# EAGLE design stm32-lqfp64-enc28j60 (EAGLE 7.2.0)
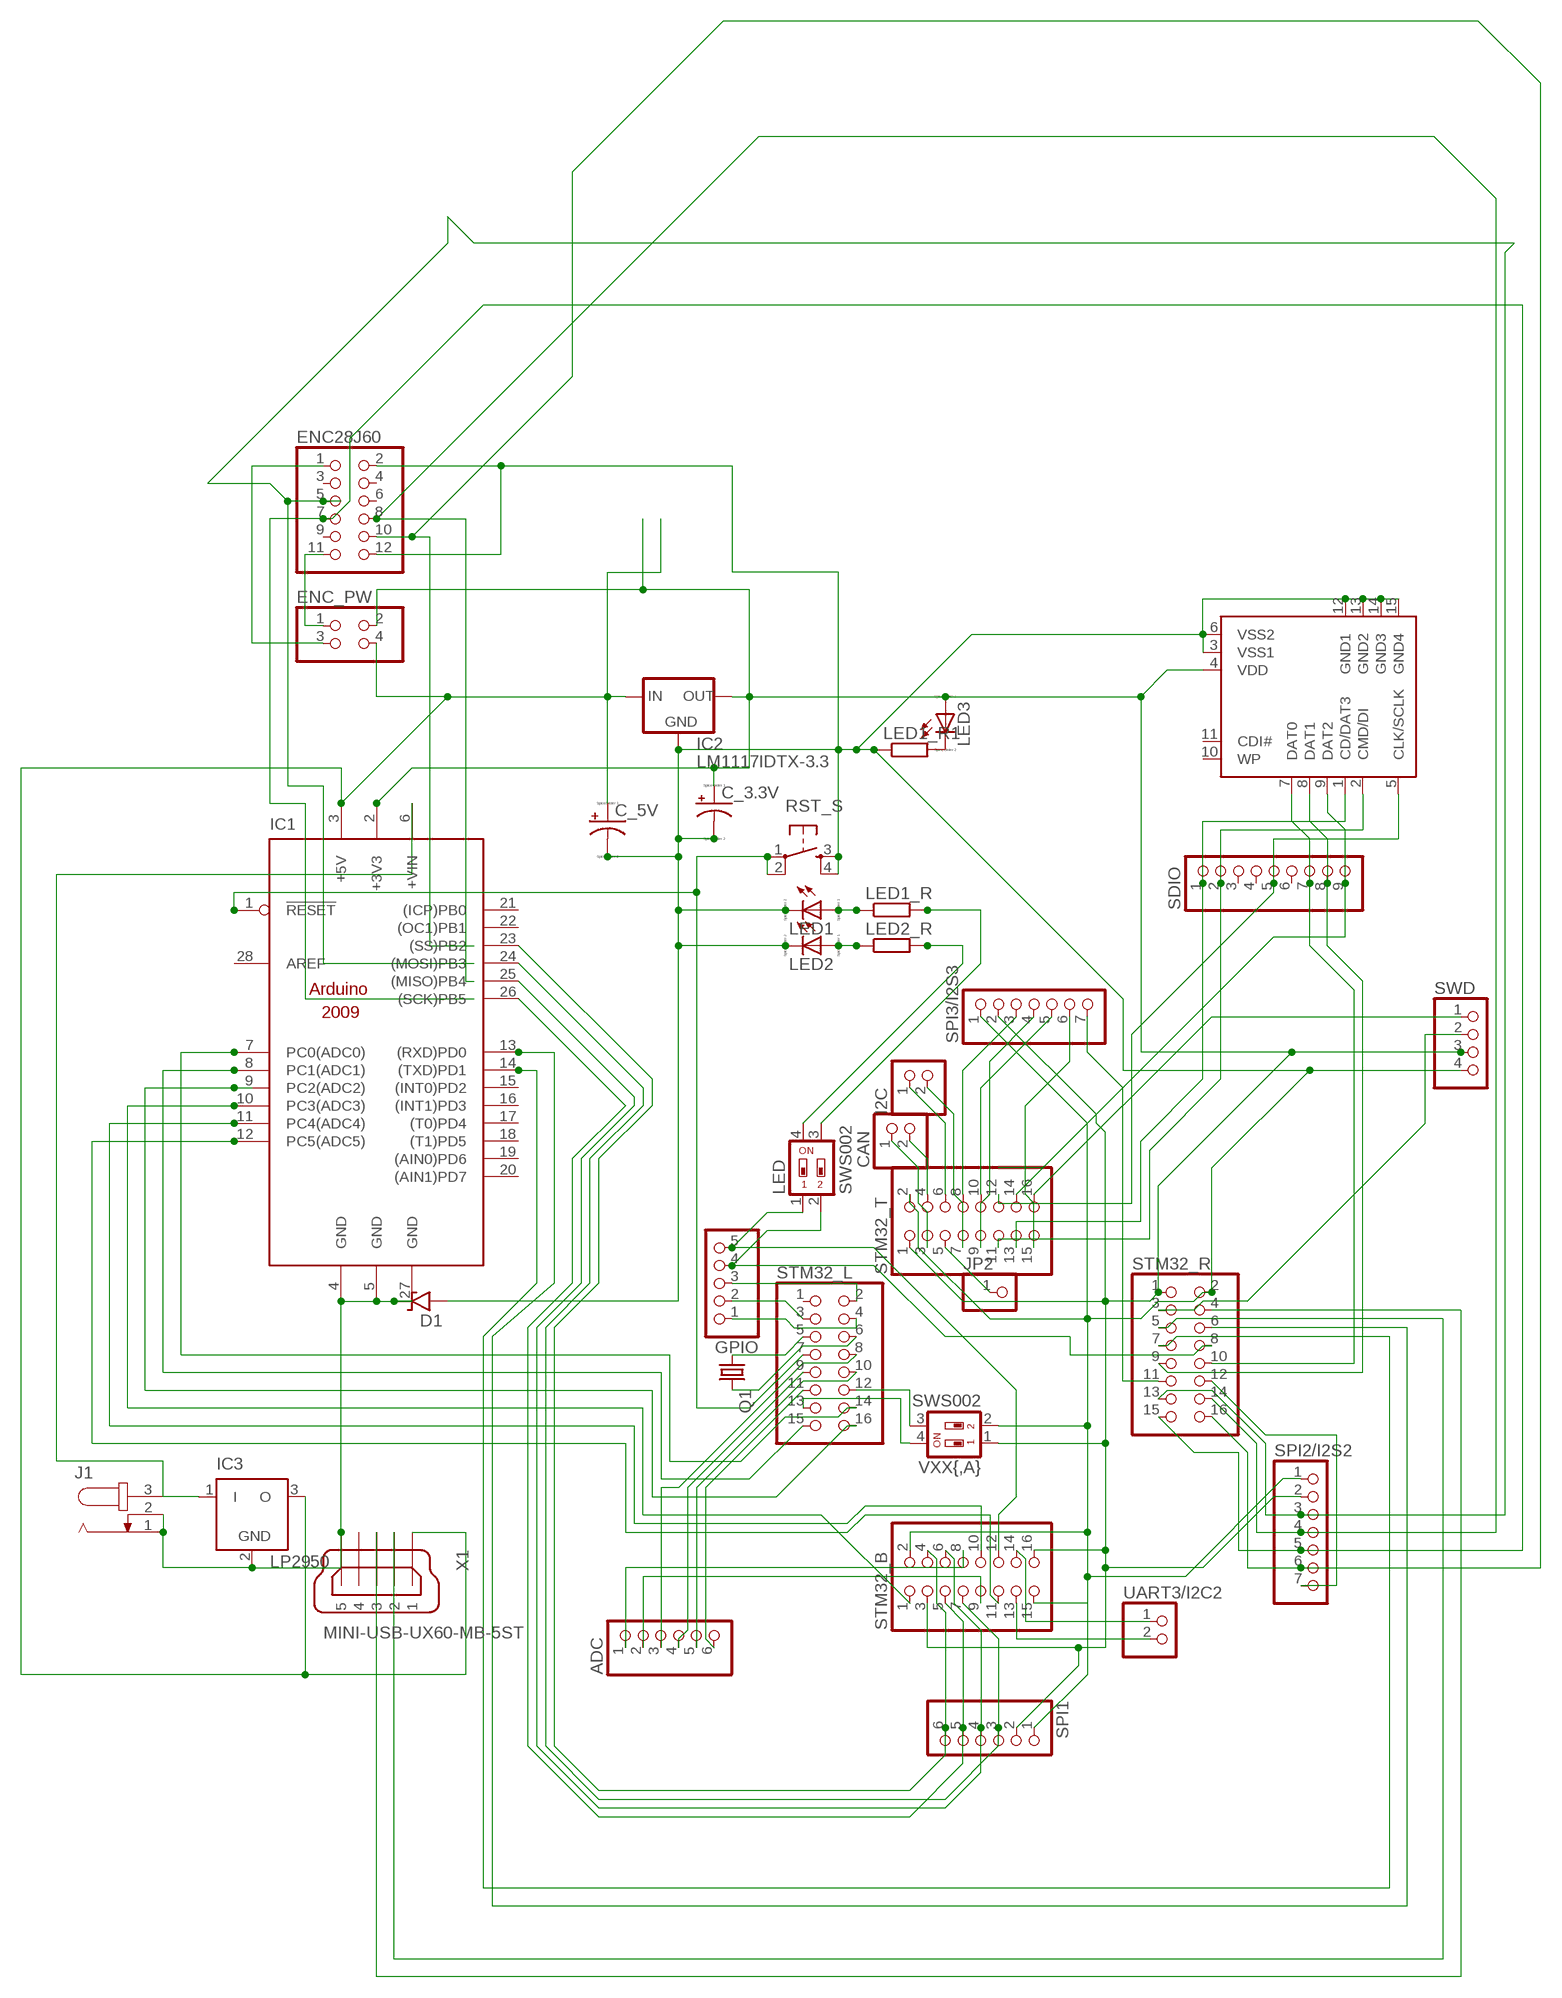
[diagram p0: schematic, sheet 1]

## Parts
ADC  PINHD-1X06_2.54-S  [1X06-S]
C_3.3V  CPOL-USE3.5-8  [E3,5-8]
C_5V  CPOL-USE3.5-8  [E3,5-8]
CAN  PINHD-1X02_2.54-S  [1X02-S]
D1  1N9ZENER2  [DO35-2]
ENC28J60  PINHD-2X6_2.54  [2X06]
ENC_PW  PINHD-2X2_2.54  [2X02]
GPIO  PINHD-1X05_2.54-S  [1X05-S]
I2C  PINHD-1X02_2.54-S  [1X02-S]
IC1  ARDUINO2009_PIN_12  [ARDUINO2009_2]
IC2  LM1117IDTX-3.3  [TO252]
IC3  LP2950  [DPACK]
J1  JACK-PLUG0  [SPC4077]
JP2  PINHD-1X01_2.54-S  [1X01-S]
LED  SWS002  [SMS-002]
LED1  LED_ELD260  [LED_LD260]
LED1_R  R-EU_0204/7  [0204/7]
LED1_R1  R-EU_0204/7  [0204/7]
LED2  LED_ELD260  [LED_LD260]
LED2_R  R-EU_0204/7  [0204/7]
LED3  LED_ELD260  [LED_LD260]
Q1  CRYSTALHC49S  [HC49/S]
RST_S  TAC_SWITCHPTH  [TACTILE-PTH]
SDIO  PINHD-1X09_2.54-S  [1X09-S]
SPI1  PINHD-1X06_2.54-S  [1X06-S]
SPI2/I2S2  PINHD-1X07_2.54-S  [1X07-S]
SPI3/I2S3  PINHD-1X07_2.54-S  [1X07-S]
STM32_B  PINHD-2X08_2.54  [2X08]
STM32_L  PINHD-2X08_2.54  [2X08]
STM32_R  PINHD-2X08_2.54  [2X08]
STM32_T  PINHD-2X08_2.54  [2X08]
SWD  PINHD-1X4  [1X04]
U$2  SDCARDVAR1  [SDCMF-10915W010]
UART3/I2C2  PINHD-1X02_2.54-S  [1X02-S]
VXX{,A}  SWS002  [SMS-002]
X1  MINI-USB-UX60-MB-5ST  [UX60-MB-5ST]

## Nets
5V: C_5V.+ ENC_PW.4 IC1.3(+5V) IC2.2(IN) IC3.3(O) X1.1
ADC1: IC1.8(PC1(ADC1)) STM32_L.15
ADC2: IC1.9(PC2(ADC2)) STM32_L.16
ADC3: IC1.10(PC3(ADC3)) STM32_B.1
ADC4: IC1.11(PC4(ADC4)) STM32_B.10
ADC5: IC1.12(PC5(ADC5)) STM32_B.11
ADC_0: IC1.7(PC0(ADC0)) STM32_L.14
GND: C_3.3V.- C_5V.- D1.A ENC28J60.2 ENC28J60.12 IC2.1(GND) LED1.K(C) LED1_R1.1 LED2.K(C) RST_S.3 RST_S.4 SPI1.1 SPI2/I2S2.1 SPI3/I2S3.1 STM32_B.2 STM32_B.15 STM32_R.2 STM32_T.2 SWD.4 U$2.3(VSS1) U$2.6(VSS2) U$2.12(GND1) U$2.13(GND2) U$2.14(GND3) U$2.15(GND4) VXX{,A}.2
GND_RAW: D1.C IC1.4(GND) IC1.5(GND) IC1.27(GND) IC3.2(GND) J1.1 J1.2 X1.5
GPIO_FREE1: GPIO.3 STM32_L.2
GPIO_FREE2: GPIO.2 STM32_L.3
GPIO_FREE3: GPIO.1 STM32_L.4
GPIO_FREE4: GPIO.5 LED.1 STM32_B.12
I2C1_SCL: I2C.2 STM32_T.7
I2C1_SDA: I2C.1 STM32_T.6
N$1: SPI3/I2S3.7 STM32_R.11
N$2: CAN.1 STM32_T.3
N$3: CAN.2 STM32_T.4
N$4: JP2.1 STM32_T.5
N$5: STM32_L.13 VXX{,A}.4
N$6: STM32_L.12 VXX{,A}.3
N$7: SPI3/I2S3.3 STM32_T.8
N$8: SPI3/I2S3.4 STM32_T.9
N$9: SPI3/I2S3.5 STM32_T.10
N$11: ADC.1 STM32_B.8
N$12: ADC.3 STM32_L.8
N$13: ADC.2 STM32_B.9
N$14: LED1_R.2 LED.3
N$15: ADC.4 STM32_L.9
N$16: ADC.5 STM32_L.10
N$17: ADC.6 STM32_L.11
N$18: STM32_B.13 UART3/I2C2.2
N$19: STM32_B.14 UART3/I2C2.1
N$20: SPI3/I2S3.6 STM32_T.15
N$21: SPI2/I2S2.7 STM32_R.12
N$22: IC1.13((RXD)PD0) STM32_R.6
N$23: SDIO.5 STM32_T.12 U$2.5(CLK/SCLK)
N$24: IC1.6(+VIN) IC3.1(I) J1.3
N$26: LED2.A LED2_R.1
N$27: LED1.A LED1_R.1
N$28: LED2_R.2 LED.4
N$46: GPIO.4 LED.2 STM32_R.8
N$47: IC1.14((TXD)PD1) STM32_R.7
N$49: STM32_R.5 X1.2
N$50: STM32_R.4 X1.3
N$187: ENC28J60.1 ENC_PW.3
N$188: ENC28J60.11 ENC_PW.1
N$242: LED1_R1.2 LED3.K(C)
RCC_OSC_IN: Q1.1 STM32_L.5
RCC_OSC_OUT: Q1.2 STM32_L.6
RST: IC1.1(!RESET) RST_S.1 RST_S.2 STM32_L.7
SDIO_CMD: SDIO.2 STM32_T.11 U$2.2(CMD/DI)
SDIO_D0: SDIO.7 STM32_R.10 U$2.7(DAT0)
SDIO_D1: SDIO.8 STM32_R.9 U$2.8(DAT1)
SDIO_D2: SDIO.9 STM32_T.14 U$2.9(DAT2)
SDIO_D3: SDIO.1 STM32_T.13 U$2.1(CD/DAT3)
SPI1_MISO: IC1.25((MISO)PB4) SPI1.4 STM32_B.6
SPI1_MOSI: IC1.24((MOSI)PB3) SPI1.3 STM32_B.7
SPI1_NSS: IC1.23((SS)PB2) SPI1.6 STM32_B.4
SPI1_SCK: IC1.26((SCK)PB5) SPI1.5 STM32_B.5
SPI2_MISO: ENC28J60.8 SPI2/I2S2.4 STM32_R.14
SPI2_MOSI: ENC28J60.5 SPI2/I2S2.3 STM32_R.13
SPI2_NSS: ENC28J60.10 SPI2/I2S2.6 STM32_R.16
SPI2_SCK: ENC28J60.7 SPI2/I2S2.5 STM32_R.15
SWD_CLK: STM32_T.16 SWD.1
SWD_IO: STM32_R.3 SWD.2
VDD: C_3.3V.+ ENC_PW.2 IC1.2(+3V3) IC2.TAB(OUT) LED3.A SPI1.2 SPI2/I2S2.2 SPI3/I2S3.2 STM32_B.3 STM32_B.16 STM32_R.1 STM32_T.1 SWD.3 U$2.4(VDD) VXX{,A}.1
Unconnected: ENC28J60.3 ENC28J60.4 ENC28J60.6 ENC28J60.9 IC1.15((INT0)PD2) IC1.16((INT1)PD3) IC1.17((T0)PD4) IC1.18((T1)PD5) IC1.19((AIN0)PD6) IC1.20((AIN1)PD7) IC1.21((ICP)PB0) IC1.22((OC1)PB1) IC1.28(AREF) SDIO.3 SDIO.4 SDIO.6 STM32_L.1 U$2.10(WP) U$2.11(CDI#) X1.4

## Library data of the parts
ADC SPI1 = pinhead-2:PINHD-1X06: PIN HEADER
C_3.3V C_5V = resistor:CPOL-US: POLARIZED CAPACITOR, American symbol
CAN I2C UART3/I2C2 = pinhead-2:PINHD-1X02: PIN HEADER
D1 = gm-diodes:1N9*ZENER: 1N9???B Zener Diode DO-35 case 1N957B - 1N992B (6.8V to 200V)
ENC28J60 = pinhead-1:PINHD-2X6: PIN HEADER
ENC_PW = pinhead-1:PINHD-2X2: PIN HEADER
GPIO = pinhead-2:PINHD-1X05: PIN HEADER
IC1 = arduino:ARDUINO2009_PIN_1: The Arduino Duemilanove ("2009") is a microcontroller board based on the ATmega168 or ATmega328. - 14 digital input/output pins (of which 6 can be used as PWM outputs) - 6 analog inputs, a 16 MHz crystal oscillator - USB connection - power jack - ISP header - reset button It contains everything needed to support the microcontroller; simply connect it to a computer with a USB cable or power it with a AC-to-DC adapter or battery to get started http://arduino.cc/en/Main/ArduinoBoardDuemilanove
IC2 = lm1117:LM1117IDTX-*
IC3 = linear:LP2950: 100 mA, Low Power Low Dropout Voltage Regulator Source: http://www.onsemi.com/pub/Collateral/LP2950-D.PDF
J1 = tango:JACK-PLUG: DC POWER JACK Power Jack, DC, Right Angle, Through Hole, Rated 5A at 16VDC, PC Terminals Distributor: Farnell (www.Farnell.de) Drawing: 84N1161.pdf / 84N1162.pdf Manufacturer: SPC Technology (www.spctechnology.com) Type: SPC4077 / SPC 4078
JP2 = pinhead-2:PINHD-1X01: PIN HEADER
LED VXX{,A} = smd-special:SWS002: SMD Dip Switch 2 pol.
LED1-LED3 = eagle-ltspice:LED_E: LED Source: http://www.osram.convergy.de Source: www.luxeon.com Source: www.kingbright.com; SPICEMODEL: NONE; SPICEPREFIX: D; SPICETYPE: diode
LED1_R LED1_R1 LED2_R = resistor:R-EU_: RESISTOR, European symbol
Q1 = crystal:CRYSTAL: CRYSTAL; OC_FARNELL: 1667008; OC_NEWARK: unknown
RST_S = SparkFun:TAC_SWITCH: Momentary Switch Button commonly used for reset or general input. Spark Fun Electronics SKU : COM-00097
SDIO = pinhead-2:PINHD-1X09: PIN HEADER
SPI2/I2S2 SPI3/I2S3 = pinhead-2:PINHD-1X07: PIN HEADER
STM32_B STM32_L STM32_R STM32_T = pinhead-2:PINHD-2X08: PIN HEADER
SWD = pinhead:PINHD-1X4: PIN HEADER
U$2 = kingfont_sdcmf10915w010:SDCARD: SD card connector KINGFONT SDCMF-10915W010
X1 = con-hirose:MINI-USB-: MINI USB Connector Source: http://www.hirose.co.jp/cataloge_hp/e24000019.pdf; OC_FARNELL: unknown; OC_NEWARK: unknown

## Board
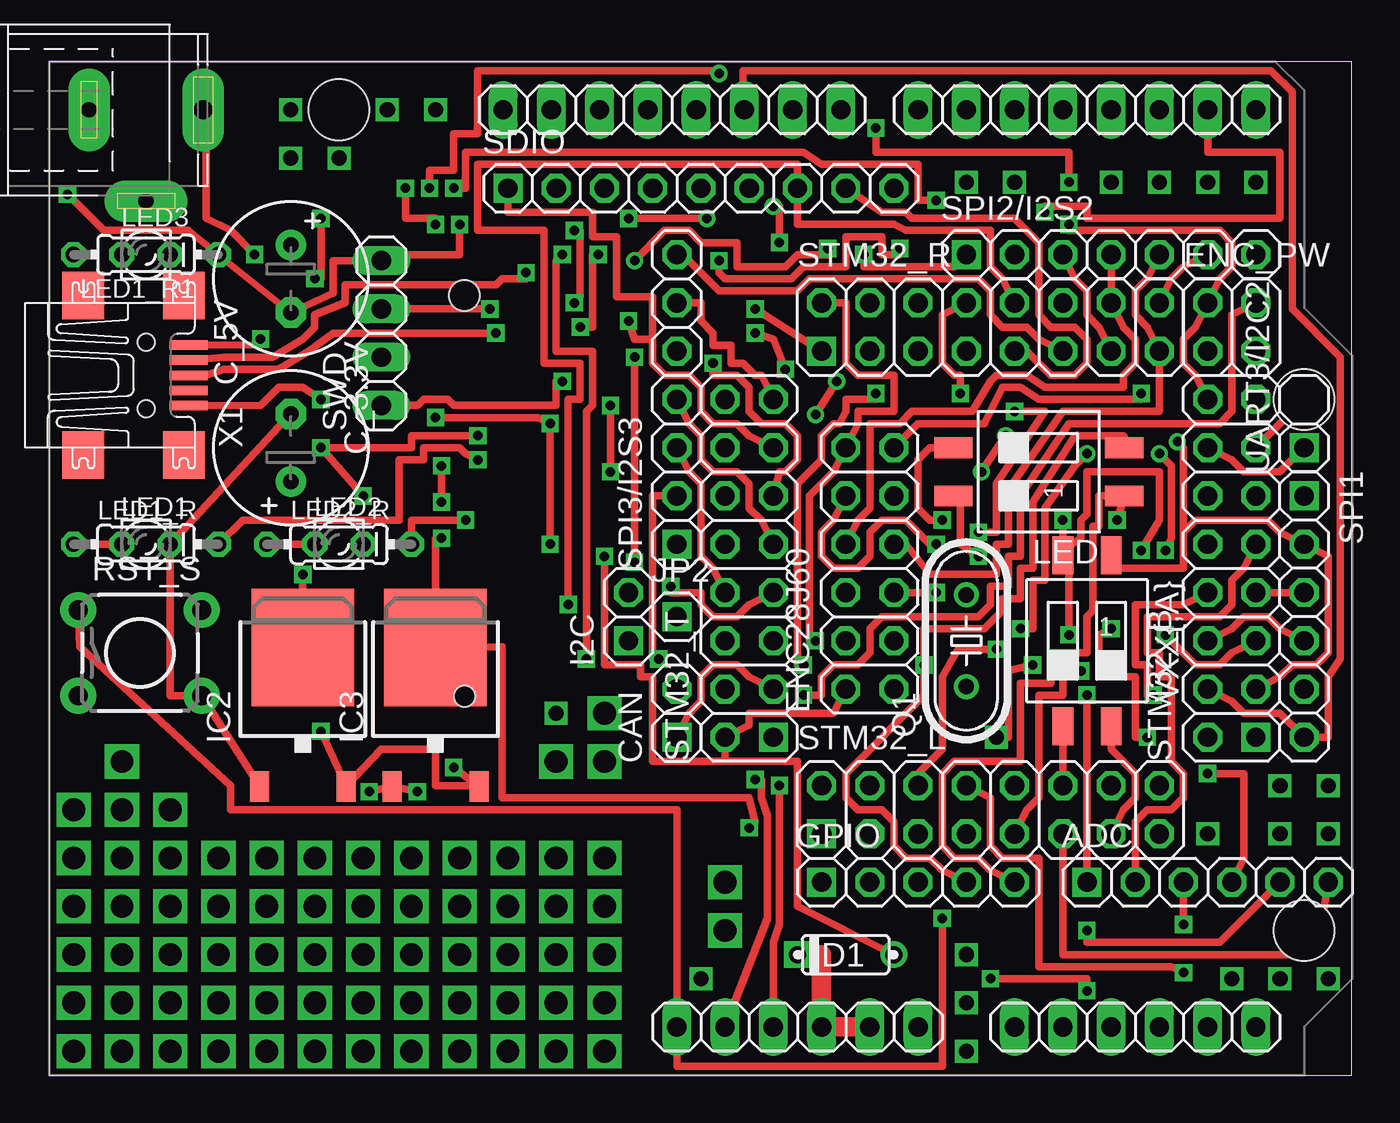
[diagram p1: board, top side]
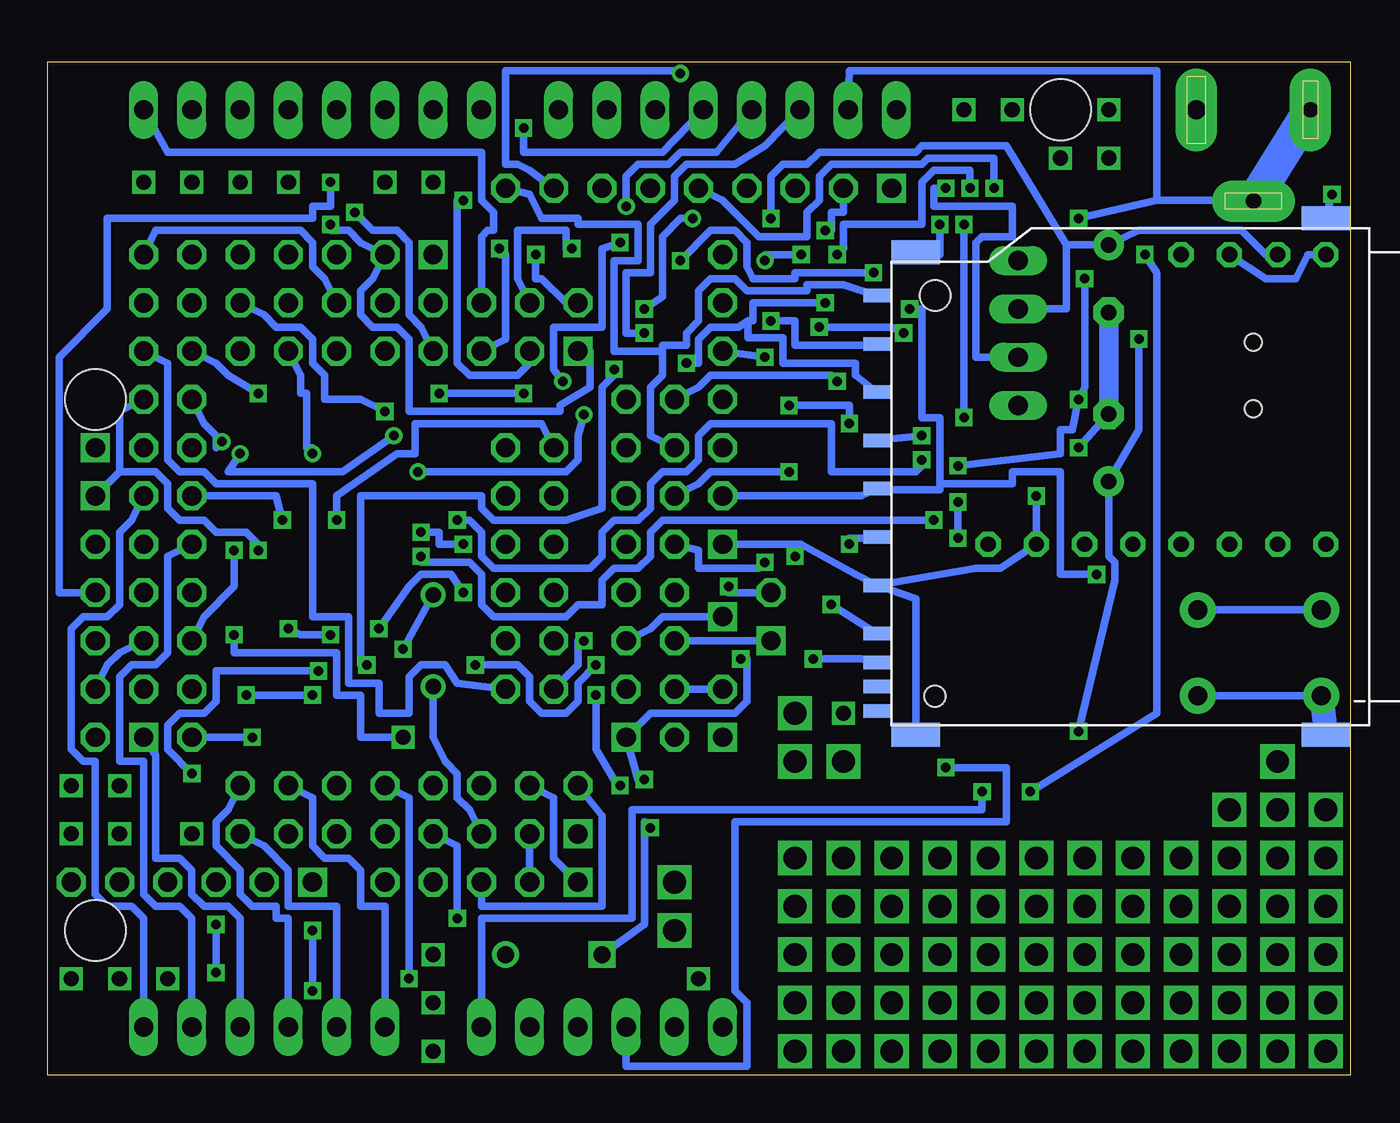
[diagram p2: board, bottom side, seen from below]

Size 68.56 x 53.33 mm. Coordinates in mm from the lower left corner, seen from the top.
Outline: 0,0 68.56,0 68.56,53.33 0,53.33 0,0
Copper layers (1*16): Top 0.035mm / dielectric 1.5mm / Bottom 0.035mm
Design rules "default": minimum track width 10mil, minimum drill 24mil, track to track 8mil, track to pad 8mil, pad to pad 8mil, via to via 8mil, smd to smd 8mil, copper to edge 40mil, drill to drill 8mil, minimum pad ring 10mil, minimum via ring 8mil, stop-mask expansion 4mil, vias tented up to drill 0mil, thermal gap 10mil

### Footprints (pad centres in the part's own frame; a part is rotated, then mirrored left to right if it is on the bottom)
1X06-S = drill 1.016 square: 1 -6.35,0 | drill 1.016 octagon: 2 -3.81,0; 3 -1.27,0; 4 1.27,0; 5 3.81,0; 6 6.35,0
E3,5-8 = drill 0.813 pad 1.6: + -1.778,0 | drill 0.813 pad 1.6 octagon: - 1.778,0
1X02-S = drill 1.016 square: 1 -1.27,0 | drill 1.016 octagon: 2 1.27,0
DO35-2 = drill 0.9: A 2.54,0 | drill 0.9 square: C -2.54,0
2X06 = drill 1.016 octagon: 1 -6.35,-1.27; 2 -6.35,1.27; 3 -3.81,-1.27; 4 -3.81,1.27; 5 -1.27,-1.27; 6 -1.27,1.27; 7 1.27,-1.27; 8 1.27,1.27; 9 3.81,-1.27; 10 3.81,1.27; 11 6.35,-1.27; 12 6.35,1.27
2X02 = drill 1.016 octagon: 1 -1.27,-1.27; 2 -1.27,1.27; 3 1.27,-1.27; 4 1.27,1.27
1X05-S = drill 1.016 square: 1 -5.08,0 | drill 1.016 octagon: 2 -2.54,0; 3 0,0; 4 2.54,0; 5 5.08,0
ARDUINO2009_2 = drill 1.016 long: 1 33.02,2.54; 2 35.56,2.54; 3 38.1,2.54; 4 40.64,2.54; 5 43.18,2.54; 6 45.72,2.54; 7 50.8,2.54; 8 53.34,2.54; 9 55.88,2.54; 10 58.42,2.54; 11 60.96,2.54; 12 63.5,2.54; 13 63.5,50.8; 14 60.96,50.8; 15 58.42,50.8; 16 55.88,50.8; 17 53.34,50.8; 18 50.8,50.8; 19 48.26,50.8; 20 45.72,50.8; 21 41.656,50.8; 22 39.116,50.8; 23 36.576,50.8; 24 34.036,50.8; 25 31.496,50.8; 26 28.956,50.8; 27 26.416,50.8; 28 23.876,50.8 | hole 3.2: 15.24,50.8; 66.04,35.56; 66.04,7.62
TO252 = smd 1 x 1.6: 1 -2.28,-4.8; 2 2.28,-4.8 | smd 5.4 x 6.2: TAB 0,2.5
DPACK = smd 1 x 1.6: 1 -2.28,-4.8; 3 2.28,-4.8 | smd 5.4 x 6.2: 2 0,2.5
SPC4077 = drill 0.8 pad 2.184 long: 1 -3,0; 2 0,-4.8 | drill 1 pad 2.184 long: 3 3,0
1X01-S = drill 1.016 square: 1 0,0
SMS-002 = smd 1.092 x 2.007: 1 -1.27,-4.496; 2 1.27,-4.496; 3 1.27,4.496; 4 -1.27,4.496
LED_LD260 = drill 0.813 octagon: A -1.27,0; K 1.27,0
0204/7 = drill 0.813 octagon: 1 -3.81,0; 2 3.81,0
HC49/S = drill 0.813: 1 -2.413,0; 2 2.413,0
TACTILE-PTH = drill 1.016 pad 1.88: 1 -3.251,2.261; 2 3.251,2.261; 3 -3.251,-2.261; 4 3.251,-2.261
1X09-S = drill 1.016 square: 1 -10.16,0 | drill 1.016 octagon: 2 -7.62,0; 3 -5.08,0; 4 -2.54,0; 5 0,0; 6 2.54,0; 7 5.08,0; 8 7.62,0; 9 10.16,0
1X07-S = drill 1.016 square: 1 -7.62,0 | drill 1.016 octagon: 2 -5.08,0; 3 -2.54,0; 4 0,0; 5 2.54,0; 6 5.08,0; 7 7.62,0
2X08 = drill 1.016 square: 1 -8.89,-1.27 | drill 1.016 octagon: 2 -8.89,1.27; 3 -6.35,-1.27; 4 -6.35,1.27; 5 -3.81,-1.27; 6 -3.81,1.27; 7 -1.27,-1.27; 8 -1.27,1.27; 9 1.27,-1.27; 10 1.27,1.27; 11 3.81,-1.27; 12 3.81,1.27; 13 6.35,-1.27; 14 6.35,1.27; 15 8.89,-1.27; 16 8.89,1.27
1X04 = drill 1.016 long: 1 -3.81,0; 2 -1.27,0; 3 1.27,0; 4 3.81,0
SDCMF-10915W010 = smd 0.711 x 1.422: 1 7.366,13.462; 2 4.826,13.462; 3 2.286,13.462; 4 -0.254,13.462; 5 -2.794,13.462; 6 -5.334,13.462; 7 -7.874,13.462; 8 -9.398,13.462; 9 9.906,13.462; 10 -11.938,13.462; 11 -10.668,13.462 | smd 1.27 x 2.54: 12 12.192,11.43; 13 13.97,-10.16; 14 -13.208,-10.16; 15 -13.208,11.43 | hole 1.6: 9.906,10.414 | hole 1.1: -11.176,10.414
UX60-MB-5ST = smd 2 x 0.5: 1 2.25,1.6; 2 2.25,0.8; 3 2.25,0; 4 2.25,-0.8; 5 2.25,-1.6 | smd 2.2 x 2.5: M1 -3.3,-4.2; M2 -3.3,4.2; M3 2,4.2; M4 2,-4.2 | hole 0.9: 0,-1.75; 0,1.75

### Placement (x,y rotation side)
ADC  60.96,10.16 0 top
C_3.3V  12.7,41.91 270 top
C_5V  12.7,33.02 90 top
CAN  33.02,19.05 90 top
D1  41.91,6.35 0 top
ENC28J60  43.18,26.67 90 top
ENC_PW  62.23,39.37 0 top
GPIO  45.72,10.16 0 top
I2C  30.48,24.13 90 top
IC1  0,0 0 top
IC2  13.34,20 0 top
IC3  20.32,20 0 top
J1  5.08,50.8 0 top
JP2  33.02,24.13 0 top
LED  52.07,31.75 90 top
LED1  5.08,27.94 0 top
LED1_R  5.08,27.94 0 top
LED1_R1  5.08,43.18 180 top
LED2  15.24,27.94 0 top
LED2_R  15.24,27.94 0 top
LED3  5.08,43.18 0 top
Q1  48.26,22.86 90 top
RST_S  4.76,22.23 0 top
SDIO  34.29,46.67 0 top
SPI1  66.04,24.13 270 top
SPI2/I2S2  55.88,43.18 0 top
SPI3/I2S3  33.02,35.56 90 top
STM32_B  62.23,26.67 90 top
STM32_L  49.53,13.97 0 top
STM32_R  49.53,39.37 0 top
STM32_T  36.83,26.67 90 top
SWD  17.46,39.05 90 top
U$2  11.43,31.11 90 bottom
UART3/I2C2  66.04,34.29 90 top
VXX{,A}  54.61,22.86 180 top
X1  5.08,36.83 0 top

### Tracks (layer width: path | path; a pad name or v marks a point on that pad's centre or on a via)
5V  (via drill 0.5)
  Top 0.406: ENC_PW.4 62.23,40.01 62.23,34.92 61.59,34.29 53.66,34.29 51.12,30.48 51.12,27.3 50.48,27.3 50.48,25.72 49.53,25.72 49.53,24.77 48.9,24.13 43.81,24.13 43.18,23.5 43.18,22.23 42.55,21.59 41.27,21.59 40.64,20.95 40.64,20 v39.69,20 | v14.29,18.1 IC2.2 17.46,17.14 20.32,17.14 20.32,15.24 22.54,15.24 22.58,15.2 IC3.3 v21.27,16.19 | v11.11,38.73 11.11,38.42 X1.1 | v38.42,15.24 38.42,7.94 38.1,6.99 IC1.3
  Bottom 0.406: v39.69,20 39.69,17.14 38.73,15.56 v38.42,15.24 | v14.29,18.1 12.38,26.04 12.38,26.99 12.7,27.3 C_5V.+ 11.11,33.97 v11.11,38.73 | v21.27,16.19 18.1,16.19 18.1,13.34 32.38,13.34 32.38,4.45 31.75,3.81 31.75,0.48 38.1,0.48 IC1.3
ADC1
  Bottom 0.406: IC1.8 53.34,8.89 55.88,8.89 55.88,10.79 57.15,12.06 STM32_L.15
ADC2
  Bottom 0.406: IC1.9 55.88,8.26 56.52,8.26 56.52,8.89 57.78,8.89 58.42,9.53 58.42,10.79 59.69,12.06 59.69,13.34 59.05,13.97 STM32_L.16
ADC3
  Bottom 0.406: IC1.10 58.42,8.26 59.05,8.89 60.33,8.89 60.96,9.53 60.96,10.79 61.59,11.43 62.87,11.43 62.87,16.83 STM32_B.1
ADC4
  Bottom 0.406: IC1.11 60.96,8.26 61.59,8.89 62.87,8.89 63.5,9.53 63.5,16.51 64.77,16.51 64.77,20.95 64.14,21.59 62.87,21.59 62.23,22.23 62.23,27.3 STM32_B.10
ADC5
  Bottom 0.406: IC1.12 63.5,8.26 64.14,8.89 65.41,8.89 66.04,9.53 66.04,16.51 66.67,16.51 67.31,17.14 67.31,23.5 66.67,24.13 65.41,24.13 64.77,24.77 64.77,28.57 64.14,29.21 STM32_B.11
ADC_0
  Bottom 0.406: IC1.7 50.8,8.89 52.07,8.89 52.07,10.79 52.7,11.43 53.98,11.43 54.61,12.06 54.61,14.61 STM32_L.14
GND  (via drill 0.5)
  Top 0.406: ENC28J60.2 41.27,19.05 36.83,19.05 36.83,18.41 STM32_T.2 35.56,16.51 | SPI2/I2S2.1 47.62,42.55 42.86,42.55 v42.86,43.18 | v21.59,44.77 21.59,43.18 17.46,43.18 SWD.4 14.92,42.86 14.92,41.15 C_3.3V.- LED1_R1.1 7.3,44.45 2.86,44.45 v0.95,46.35 | C_5V.- LED1.K 6.35,19.96 RST_S.4 IC2.1 | v16.51,30.48 v14.29,33.02 19.05,33.02 19.05,33.66 v22.54,33.66 | D1.A 39.37,8.89 39.37,16.51 35.56,16.51 | v29.21,27.3 29.21,21.59 31.11,21.59 31.11,20.95 31.75,20.95 31.75,16.51 35.56,16.51 | STM32_R.2 41.91,40.64 41.91,37.47 42.55,36.83 44.45,36.83 44.45,34.92 42.55,34.92 42.55,34.29 ENC28J60.12 41.27,31.75 40.01,30.48 40.01,22.86 v40.32,22.86 | v53.34,29.21 VXX{,A}.2 | VXX{,A}.2 53.61,27.36 53.66,27.3 v53.66,23.18 | v55.88,23.5 55.24,23.18 55.24,20.95 57.15,20.95 57.15,17.78 v57.78,17.78 | VXX{,A}.2 53.34,27.62 54.29,28.26 54.29,29.21 54.61,29.53 54.61,31.75 58.42,31.75 58.42,29.21 v57.47,27.62
  Bottom 0.406: RST_S.4 RST_S.3 | v42.86,43.18 42.86,41.91 42.55,41.91 41.27,40.64 STM32_R.2 | SPI1.1 64.77,31.75 | 64.77,31.75 64.77,34.92 STM32_B.15 | v21.59,44.77 21.59,43.18 U$2.12 | C_5V.- v14.29,33.02 | v16.51,30.48 LED2.K 18.41,26.67 19.68,26.67 U$2.6 | U$2.3 v22.54,33.66 | v0.95,46.35 U$2.13 | U$2.15 22.86,25.08 U$2.6 | SPI3/I2S3.1 29.21,27.94 | 29.21,27.94 28.89,27.94 26.04,26.35 U$2.6 | 29.21,27.94 v29.21,27.3 | v40.32,22.86 40.64,22.86 40.64,21.59 ENC28J60.2 | ENC28J60.12 42.55,34.29 49.21,34.29 49.21,32.7 50.16,32.7 53.34,30.48 v53.34,29.21 | v53.66,23.18 55.24,23.18 v55.88,23.5 | v57.78,17.78 STM32_B.2 | v57.47,27.62 57.47,27.94 58.1,28.57 59.69,28.57 60.33,29.21 61.59,29.21 62.23,29.84 62.23,31.11 62.87,31.75 64.77,31.75
  Bottom 1.016: C_5V.- C_3.3V.-
  Bottom 1.27: RST_S.3 U$2.14
GND_RAW  (via drill 0.5)
  Top 0.406: X1.5 11.11,35.24 12.06,36.2 13.34,36.2 v14.29,35.56 | v13.97,41.91 14.29,41.91 v14.29,45.09 | v36.83,13.02 37.15,13.34 36.83,14.61 23.81,14.61 23.81,22.54 IC3.2 20.32,28.26 v20.64,28.26 | v20.64,30.16 v20.64,32.07
  Top 1.016: D1.C 40.64,6.35 IC1.4 IC1.5
  Bottom 0.406: J1.2 6.99,46.04 10.16,46.04 | 10.16,46.04 10.16,52.86 26.35,52.86 IC1.27 | v13.97,41.91 13.97,36.2 v14.29,35.56 14.61,33.97 15.24,33.97 15.24,32.7 v20.64,32.07 | v14.29,45.09 10.16,46.04 | D1.C 37.15,7.94 37.15,13.34 v36.83,13.02 | v20.64,28.26 v20.64,30.16
  Bottom 1.778: J1.2 J1.1
GPIO_FREE1
  Bottom 0.406: STM32_L.2 39.37,13.65 39.37,8.89 45.72,8.89 GPIO.3
GPIO_FREE2
  Bottom 0.406: GPIO.2 STM32_L.3
GPIO_FREE3
  Bottom 0.406: GPIO.1 41.91,11.43 41.91,14.61 STM32_L.4
GPIO_FREE4  (via drill 0.5)
  Top 0.406: GPIO.5 49.53,10.79 48.9,11.43 47.62,11.43 46.99,12.06 46.99,15.88 47.62,16.51 51.12,16.51 51.12,20.64 52.7,20.64 52.7,22.23 54.61,22.23 54.61,24.13 54.93,24.45 54.93,28.89 55.24,28.89 55.24,30.48 LED.1 v56.2,29.21
  Bottom 0.406: v56.2,29.21 56.52,30.48 STM32_B.12
I2C1_SCL  (via drill 0.5)
  Top 0.406: STM32_T.7 36.83,24.77 36.2,24.13 34.92,24.13 34.29,24.77 34.29,25.4 32.7,25.4 v32.7,25.72
  Bottom 0.406: v32.7,25.72 32.7,25.4 I2C.2
I2C1_SDA
  Bottom 0.406: STM32_T.6 I2C.1
N$1
  Top 0.406: SPI3/I2S3.7 33.34,43.18 35.24,41.27 39.37,41.27 40.01,41.91 48.9,41.91 49.53,41.27 49.53,40.01 50.16,39.37 51.44,39.37 52.07,38.73 STM32_R.11
N$2
  Top 0.406: STM32_T.3 36.83,20.95 36.2,21.59 34.92,21.59 34.29,20.95 34.29,19.68 33.66,19.05 CAN.1
N$3
  Bottom 0.406: STM32_T.4 CAN.2
N$4
  Bottom 0.406: STM32_T.5 36.83,23.5 36.2,24.13 JP2.1
N$5
  Top 0.406: STM32_L.13 56.52,13.97 57.15,14.61 57.15,15.88 55.88,17.14 VXX{,A}.4
N$6
  Top 0.406: STM32_L.12 VXX{,A}.3
N$7
  Top 0.406: SPI3/I2S3.3 33.66,31.75 34.29,31.11 34.29,27.3 34.92,26.67 STM32_T.8
N$8
  Top 0.406: SPI3/I2S3.4 33.66,34.29 34.29,33.66 34.29,32.38 34.92,31.75 36.2,31.75 36.83,31.11 36.83,29.84 37.47,29.21 STM32_T.9
N$9  (via drill 0.5)
  Top 0.406: v30.8,26.99 v30.8,37.78
  Bottom 0.406: STM32_T.10 34.29,27.62 34.29,26.67 31.11,26.67 v30.8,26.99 | v30.8,37.78 SPI3/I2S3.5
N$11  (via drill 0.5)
  Top 0.406: ADC.1 v54.61,20 | v58.1,20 57.78,20 57.78,21.59 57.15,21.59 57.15,24.77 59.69,24.77 STM32_B.8
  Bottom 0.406: v54.61,20 v58.1,20
N$12  (via drill 0.5)
  Top 0.406: ADC.3 v59.69,7.94 | v59.69,5.4 59.05,5.71 52.07,5.71 52.07,11.43 50.16,11.43 49.53,12.06 49.53,14.61 STM32_L.8
  Bottom 0.406: v59.69,7.94 v59.69,5.4
N$13
  Top 0.406: ADC.2 57.15,13.34 57.78,13.97 59.05,13.97 59.69,14.61 59.69,15.88 59.05,16.51 59.05,20.95 58.42,20.95 58.42,22.23 57.78,22.23 57.78,24.13 61.59,24.13 62.23,24.77 62.23,26.04 62.87,26.67 STM32_B.9
N$14  (via drill 0.5)
  Top 0.406: LED1_R.2 10.16,29.21 18.41,29.21 18.41,32.38 19.68,32.38 19.68,33.02 21.59,33.02 21.91,32.7 v22.54,32.38 | v46.99,29.21 46.35,29.21 45.72,29.84 45.72,32.38 46.35,33.02 LED.3
  Bottom 0.406: v22.54,32.38 22.54,32.07 22.86,31.75 27.3,31.75 27.3,34.29 33.66,34.29 34.29,33.66 34.29,32.38 34.92,31.75 36.2,31.75 36.83,31.11 36.83,29.84 37.47,29.21 38.73,29.21 39.37,28.57 39.37,27.3 40.01,26.67 45.09,26.67 45.72,27.3 45.72,28.57 46.35,29.21 v46.99,29.21
N$15  (via drill 0.5)
  Top 0.406: STM32_L.9 51.44,13.97 52.07,14.61 52.07,20 53.34,20 53.34,21.27 v54.29,21.27 | v60.96,15.88 62.87,15.88 62.87,11.43 ADC.4
  Bottom 0.406: v54.29,21.27 59.69,21.27 59.69,19.68 60.33,19.05 61.59,19.05 62.23,18.41 62.23,17.14 v60.96,15.88
N$16  (via drill 0.5)
  Top 0.406: ADC.5 61.59,6.99 54.61,6.99 v54.61,7.62 | v54.61,4.45 54.61,5.08 v49.53,5.08
  Bottom 0.406: v54.61,7.62 v54.61,4.45 | v49.53,5.08 49.53,14.61 STM32_L.10
N$17
  Top 0.406: ADC.6 66.67,6.35 59.69,6.35 53.34,6.35 STM32_L.11
N$18
  Top 0.406: STM32_B.13 UART3/I2C2.2
N$19
  Top 0.406: UART3/I2C2.1 64.77,31.75 62.87,31.75 62.23,32.38 STM32_B.14
N$20
  Top 0.406: SPI3/I2S3.6 34.29,40.64 34.29,39.69 34.92,39.05 34.92,38.42 35.88,38.42 35.88,37.47 36.51,37.47 37.15,36.83 37.47,36.83 STM32_T.15
N$21
  Bottom 0.406: STM32_R.12 53.98,41.91 54.61,42.55 54.61,43.81 55.24,44.45 62.87,44.45 SPI2/I2S2.7
N$22
  Bottom 0.406: IC1.13 62.23,48.58 45.72,48.58 45.72,46.04 45.09,45.4 45.09,44.45 45.4,44.45 45.72,44.13 STM32_R.6
N$23  (via drill 0.5)
  Top 0.406: v26.35,27.94 v26.35,34.29 25.72,34.61 v20.32,34.61 | v29.53,35.24 v29.53,31.75 | v18.73,46.67 18.73,45.09 20.32,45.09 v20.32,44.77
  Bottom 0.406: U$2.5 25.72,28.26 26.35,28.26 v26.35,27.94 | v26.35,34.29 26.35,35.24 v29.53,35.24 | v29.53,31.75 33.66,31.75 34.29,31.11 STM32_T.12 | SDIO.5 33.02,46.04 31.11,44.13 28.57,44.13 28.57,45.4 27.94,46.04 27.94,47.31 27.3,47.94 22.54,47.94 22.23,48.26 18.73,48.26 v18.73,46.67 | v20.32,44.77 v20.32,34.61
N$24  (via drill 0.5)
  Top 0.406: J1.3 8.26,48.9 8.26,45.09 9.53,44.45 v10.79,43.18 | v16.83,14.92 IC3.1 v19.37,14.92
  Bottom 0.406: v10.79,43.18 10.16,42.23 10.16,19.05 v16.83,14.92 | v19.37,14.92 19.37,13.97 37.78,13.97 37.78,8.26 45.72,8.26 IC1.6
N$25  (via drill 1.2)
  other vias: 1.27,1.27
N$26
  Top 0.406: LED2_R.1 LED2.A
N$27
  Top 0.406: LED1.A LED1_R.1
N$28  (via drill 0.5)
  Top 0.406: LED2_R.2 19.05,29.21 v21.91,29.21 | v48.9,27.3 47.94,27.94 47.94,30.48 LED.4
  Bottom 0.406: v48.9,27.3 48.9,26.99 46.35,26.99 45.72,26.35 45.72,24.77 45.09,24.13 41.27,24.13 40.64,24.77 39.37,24.77 39.37,26.04 38.73,26.67 37.47,26.67 36.83,27.3 36.83,28.57 36.2,29.21 v21.91,29.21
N$29  (via drill 1.2)
  other vias: 3.81,1.27
N$30  (via drill 1.2)
  other vias: 1.27,3.81
N$31  (via drill 1.2)
  other vias: 6.35,1.27
N$32  (via drill 1.2)
  other vias: 3.81,3.81
N$33  (via drill 1.2)
  other vias: 1.27,6.35
N$34  (via drill 1.2)
  other vias: 1.27,8.89
N$35  (via drill 1.2)
  other vias: 1.27,11.43
N$36  (via drill 1.2)
  other vias: 1.27,13.97
N$37  (via drill 1.2)
  other vias: 3.81,6.35
N$38  (via drill 1.2)
  other vias: 3.81,8.89
N$39  (via drill 1.2)
  other vias: 3.81,11.43
N$40  (via drill 1.2)
  other vias: 3.81,13.97
N$41  (via drill 1.2)
  other vias: 3.81,16.51
N$42  (via drill 1.2)
  other vias: 6.35,3.81
N$43  (via drill 1.2)
  other vias: 6.35,6.35
N$44  (via drill 1.2)
  other vias: 6.35,8.89
N$45  (via drill 1.2)
  other vias: 6.35,11.43
N$46  (via drill 0.5)
  Top 0.406: GPIO.4 46.99,10.79 46.35,11.43 45.09,11.43 44.45,12.06 44.45,13.34 43.81,13.97 42.55,13.97 41.91,14.61 41.91,15.88 46.04,20 v46.04,21.59 46.04,23.5 49.21,23.5 50.16,24.45 50.16,25.08 51.12,25.08 51.12,26.67 51.75,26.67 51.75,30.16 53.98,33.66 56.52,33.66 56.57,33.6 LED.2 | STM32_R.8 46.99,40.01 46.99,37.47 47.62,36.83 47.94,36.83 v47.94,35.88 | v43.5,35.88 43.5,35.56 41.91,35.56 41.91,34.92 41.59,34.29 41.27,34.29 40.64,33.66 40.64,32.38 39.37,31.11 39.37,21.59 v39.69,21.59
  Bottom 0.406: v47.94,35.88 v43.5,35.88 | v39.69,21.59 40.64,20.64 40.64,19.68 41.27,19.05 42.55,19.05 43.18,19.68 43.18,20.95 43.81,21.59 v46.04,21.59
N$47  (via drill 0.5)
  Top 0.406: v52.39,45.4 52.39,45.72 54.61,45.72 54.61,45.09 64.77,45.09 64.77,48.58 60.96,48.58 IC1.14
  Bottom 0.406: STM32_R.7 48.9,39.37 49.53,40.01 49.53,43.81 50.16,44.45 51.44,44.45 v52.39,45.4
N$48  (via drill 1.2)
  other vias: 6.35,13.97
N$49  (via drill 0.5)
  Top 0.406: X1.2 9.21,37.78 11.75,37.78 13.34,38.73 13.97,39.37 13.97,40.01 15.56,40.64 15.56,41.59 23.5,41.59 23.81,41.91 25.08,41.91 v25.08,42.23 | v35.24,42.86 35.24,42.23 35.56,41.91 39.05,41.91 39.69,42.55 41.91,42.55 41.91,44.13 43.81,44.13 43.81,43.18 44.77,43.18 v44.77,43.5
  Bottom 0.406: v25.08,42.23 29.21,42.23 29.21,41.91 31.43,41.91 31.75,42.55 31.75,43.81 32.38,44.45 33.66,44.45 v35.24,42.86 | v44.77,43.5 44.77,43.18 44.45,43.18 44.45,38.73 STM32_R.5
N$50  (via drill 0.5)
  Top 0.406: X1.3 8.26,36.83 9.21,37.15 12.06,37.15 13.65,38.1 14.92,39.05 v23.5,39.05 | v27.94,39.37 28.57,39.37 28.57,43.18 v28.89,43.18 | v30.8,42.86 32.38,44.45 33.66,44.45 34.29,43.81 36.2,43.81 36.2,42.55 38.73,42.55 39.37,43.18 40.96,43.18 v40.96,43.5
  Bottom 0.406: v23.5,39.05 24.13,39.37 v27.94,39.37 | v28.89,43.18 30.8,43.18 v30.8,42.86 | v40.96,43.5 41.27,43.5 41.27,44.45 43.81,44.45 43.81,41.91 STM32_R.4
N$51  (via drill 1.2)
  other vias: 8.89,1.27
N$52  (via drill 1.2)
  other vias: 8.89,3.81
N$53  (via drill 1.2)
  other vias: 8.89,6.35
N$54  (via drill 1.2)
  other vias: 8.89,8.89
N$55  (via drill 1.2)
  other vias: 8.89,11.43
N$56  (via drill 1.2)
  other vias: 11.43,1.27
N$57  (via drill 1.2)
  other vias: 11.43,3.81
N$58  (via drill 1.2)
  other vias: 11.43,6.35
N$59  (via drill 1.2)
  other vias: 11.43,8.89
N$60  (via drill 1.2)
  other vias: 11.43,11.43
N$61  (via drill 1.2)
  other vias: 13.97,1.27
N$62  (via drill 1.2)
  other vias: 13.97,3.81
N$63  (via drill 1.2)
  other vias: 13.97,6.35
N$64  (via drill 1.2)
  other vias: 13.97,8.89
N$65  (via drill 1.2)
  other vias: 13.97,11.43
N$66  (via drill 1.2)
  other vias: 16.51,1.27
N$67  (via drill 1.2)
  other vias: 19.05,1.27
N$68  (via drill 1.2)
  other vias: 21.59,1.27
N$69  (via drill 1.2)
  other vias: 24.13,1.27
N$70  (via drill 1.2)
  other vias: 26.67,1.27
N$71  (via drill 1.2)
  other vias: 29.21,1.27
N$72  (via drill 1.2)
  other vias: 29.21,3.81
N$73  (via drill 1.2)
  other vias: 29.21,6.35
N$74  (via drill 1.2)
  other vias: 29.21,8.89
N$75  (via drill 1.2)
  other vias: 29.21,11.43
N$76  (via drill 1.2)
  other vias: 26.67,11.43
N$77  (via drill 1.2)
  other vias: 24.13,11.43
N$78  (via drill 1.2)
  other vias: 21.59,11.43
N$79  (via drill 1.2)
  other vias: 19.05,11.43
N$80  (via drill 1.2)
  other vias: 16.51,11.43
N$81  (via drill 1.2)
  other vias: 16.51,8.89
N$82  (via drill 1.2)
  other vias: 16.51,6.35
N$83  (via drill 1.2)
  other vias: 16.51,3.81
N$84  (via drill 1.2)
  other vias: 19.05,3.81
N$85  (via drill 1.2)
  other vias: 19.05,6.35
N$86  (via drill 1.2)
  other vias: 19.05,8.89
N$87  (via drill 1.2)
  other vias: 21.59,8.89
N$88  (via drill 1.2)
  other vias: 21.59,6.35
N$89  (via drill 1.2)
  other vias: 21.59,3.81
N$90  (via drill 1.2)
  other vias: 26.67,3.81
N$91  (via drill 1.2)
  other vias: 26.67,6.35
N$92  (via drill 1.2)
  other vias: 26.67,8.89
N$93  (via drill 1.2)
  other vias: 24.13,8.89
N$94  (via drill 1.2)
  other vias: 24.13,6.35
N$95  (via drill 1.2)
  other vias: 24.13,3.81
N$96  (via drill 1.2)
  other vias: 26.67,16.51
N$97  (via drill 1.2)
  other vias: 29.21,16.51
N$98  (via drill 1.2)
  other vias: 29.21,19.05
N$99  (via drill 1.2)
  other vias: 35.56,7.62
N$100  (via drill 1.2)
  other vias: 35.56,10.16
N$101  (via drill 0.8)
  other vias: 34.29,5.08
N$102  (via drill 0.8)
  other vias: 48.26,1.27
N$103  (via drill 0.8)
  other vias: 48.26,3.81
N$104  (via drill 0.8)
  other vias: 48.26,6.35
N$105  (via drill 0.8)
  other vias: 64.77,5.08
N$106  (via drill 0.8)
  other vias: 67.31,5.08
N$107  (via drill 0.8)
  other vias: 62.23,5.08
N$108  (via drill 0.8)
  other vias: 67.31,12.7
N$109  (via drill 0.8)
  other vias: 67.31,15.24
N$110  (via drill 0.8)
  other vias: 64.77,12.7 64.77,15.24
N$111  (via drill 0.8)
  other vias: 60.96,12.7
N$112  (via drill 0.8)
  other vias: 63.5,46.99
N$113  (via drill 0.8)
  other vias: 60.96,46.99
N$114  (via drill 0.8)
  other vias: 58.42,46.99
N$117  (via drill 0.8)
  other vias: 20.32,50.8
N$118  (via drill 0.8)
  other vias: 17.78,50.8
N$119  (via drill 0.8)
  other vias: 15.24,50.8
N$120  (via drill 0.8)
  other vias: 12.7,50.8
N$121  (via drill 0.8)
  other vias: 12.7,48.26
N$122  (via drill 0.8)
  other vias: 15.24,48.26
N$123  (via drill 0.8)
  other vias: 26.67,19.05
N$124  (via drill 0.8)
  other vias: 55.88,46.99
N$125  (via drill 0.8)
  other vias: 48.26,46.99
N$126  (via drill 0.8)
  other vias: 50.8,46.99
N$187
  Bottom 0.406: ENC28J60.1 46.99,20.64 47.62,21.59 48.9,21.59 49.53,20.95 49.53,19.05 51.12,19.05 51.12,20.64 52.7,20.64 52.7,24.13 54.61,24.13 54.61,31.11 59.69,31.11 60.33,31.75 61.59,31.75 62.23,32.38 62.23,37.47 ENC_PW.3
N$188  (via drill 0.5)
  Top 0.406: v57.47,35.88 57.47,35.56 52.07,35.56 51.12,36.2 50.16,36.2 49.21,34.29 46.35,34.29 45.72,34.29 ENC28J60.11
  Bottom 0.406: ENC_PW.1 59.69,37.47 59.05,36.83 v57.47,35.88
N$242
  Bottom 0.406: LED3.K 4.45,41.91 2.86,41.91 2.22,43.18 LED1_R1.2
RCC_OSC_IN
  Bottom 0.406: STM32_L.5 46.35,13.97 46.99,14.61 46.99,15.88 47.62,16.51 48.26,17.78 Q1.1
RCC_OSC_OUT  (via drill 0.5)
  Top 0.406: STM32_L.6 45.72,15.88 46.99,17.14 46.99,20.95 47.82,22.42 v49.85,22.42
  Bottom 0.406: v49.85,22.42 Q1.2
RST  (via drill 0.5)
  Top 0.406: v46.99,8.26 46.99,0.48 33.02,0.48 IC1.1 33.02,13.97 9.53,13.97 9.53,15.24 1.59,22.54 RST_S.1
  Bottom 0.406: v46.99,8.26 46.99,12.06 STM32_L.7 | RST_S.2 RST_S.1
SDIO_CMD  (via drill 0.5)
  Top 0.406: STM32_T.11 38.42,31.75 38.73,31.75 39.37,32.38 39.37,33.66 38.73,34.29 37.47,34.29 36.83,34.92 36.83,36.2 36.2,36.83 34.92,36.83 v34.92,37.47 | v27.62,40.64 27.94,40.96 27.94,44.45 v27.62,44.45
  Bottom 0.406: v34.92,37.47 34.29,37.47 34.29,38.73 33.66,39.37 32.19,39.37 31.69,39.69 | v27.62,40.64 31.43,40.64 31.43,39.69 31.69,39.69 | v27.62,44.45 27.3,44.45 27.3,45.4 26.67,45.4 SDIO.2 | U$2.2 26.04,36.83 26.04,37.47 29.84,37.47 29.84,38.8 31.69,38.8 31.69,39.69
SDIO_D0  (via drill 0.5)
  Top 0.406: STM32_R.10 50.16,41.91 49.53,42.55 49.53,44.45 45.09,44.45 44.45,44.77 39.37,44.77 SDIO.7 39.37,47.94 22.54,47.94 22.54,44.45 26.04,44.45 26.04,37.47 27.94,37.47 27.94,35.56 27.3,35.56 v27.3,24.77
  Bottom 0.406: U$2.7 v27.3,24.77
SDIO_D1  (via drill 0.5)
  Top 0.406: v28.26,21.91 28.26,34.92 28.57,35.24 28.57,38.1 26.67,38.1 26.67,42.86 v26.99,43.18 | v20,46.67 20,47.62 21.27,47.62 21.27,49.53 22.54,49.53 22.54,52.86 35.24,52.86 v35.24,52.7 | SDIO.8 43.81,45.4 45.09,45.4 45.4,45.09 50.8,45.09 52.07,43.81 52.07,40.01 52.7,39.37 53.98,39.37 54.61,38.73 54.61,37.47 53.98,36.83 52.7,36.83 51.44,38.1 STM32_R.9
  Bottom 0.406: U$2.8 25.72,21.91 v28.26,21.91 | v26.99,43.18 26.67,43.5 26.67,44.77 22.54,44.77 22.54,46.99 21.91,47.62 20,47.62 v20,46.67 | v35.24,52.7 35.24,52.86 44.45,52.86 44.45,47.94 43.81,47.94 43.18,47.62 SDIO.8
SDIO_D2
  Bottom 0.406: SDIO.9 43.18,46.35 42.55,45.09 40.64,45.09 40.64,44.77 37.47,44.77 37.47,42.86 38.73,42.86 38.73,38.1 36.2,38.1 | 36.2,38.1 36.2,38.42 34.92,38.42 34.92,39.05 34.29,39.69 34.29,41.27 33.66,41.91 32.38,41.91 31.75,41.27 28.57,41.27 28.57,41.59 26.67,41.59 U$2.9 | 36.2,38.1 36.2,36.83 36.83,36.2 36.83,33.66 STM32_T.14
SDIO_D3  (via drill 0.5)
  Top 0.406: STM32_T.13 36.83,33.66 36.2,34.29 34.92,34.29 34.29,34.92 34.29,36.2 33.66,36.83 32.38,36.83 31.75,37.47 31.75,38.73 | 31.75,38.73 31.75,40.96 29.84,40.96 29.84,44.13 28.57,44.13 28.57,45.4 24.13,45.4 SDIO.1 | v30.48,39.69 30.8,38.73 31.75,38.73
  Bottom 0.406: U$2.1 25.72,38.42 29.21,38.42 29.21,39.69 v30.48,39.69
SPI1_MISO  (via drill 0.5)
  Top 0.406: SPI1.4 64.77,23.5 64.14,24.13 62.87,24.13 62.23,23.5 STM32_B.6 | v38.1,45.72 38.42,45.72 v38.42,43.81 | v41.44,36.51 v40.32,34.76 | v49.05,31.75 v50.32,33.66 | v58.42,32.7 59.05,32.07 59.05,28.26 v58.74,27.62
  Bottom 0.406: IC1.25 33.34,48.58 35.24,48.58 35.88,47.94 37.47,47.94 38.1,47.31 v38.1,45.72 | STM32_B.6 60.33,24.13 58.74,25.72 v58.74,27.62 | v38.42,43.81 39.37,43.5 39.37,39.37 41.91,39.37 41.91,37.15 v41.44,36.51 | v40.32,34.76 40.64,33.66 40.64,32.38 41.27,31.75 v49.05,31.75 | v50.32,33.66 53.02,31.75 59.05,31.75 v58.42,32.7
SPI1_MOSI  (via drill 0.5)
  Top 0.406: SPI1.3 STM32_B.7 | v43.5,49.85 43.5,48.58 53.66,48.58 v53.66,46.99
  Bottom 0.406: IC1.24 35.56,49.21 36.2,48.58 43.5,48.58 v43.5,49.85 | v53.66,46.99 53.66,45.72 54.61,45.72 54.61,45.09 65.41,45.09 65.41,40.32 67.94,37.78 67.94,25.4 SPI1.3
SPI1_NSS
  Top 0.406: STM32_B.4 62.23,19.68 62.87,19.05 64.77,19.05 SPI1.6 67.31,17.78 67.31,20.95 67.94,21.91 67.94,37.78 65.41,40.32 65.41,51.75 64.29,52.86 36.51,52.86 36.51,50.8 IC1.23
SPI1_SCK  (via drill 0.5, 0.8)
  Top 0.406: STM32_B.5 62.23,22.23 61.59,21.59 60.33,21.59 v58.74,23.18 | v37.15,39.05 38.1,38.73 v38.73,37.15 | v51.75,21.59 50.48,21.27 50.48,17.78 v49.85,17.78
  Bottom 0.406: SPI1.5 65.41,21.59 64.77,22.23 STM32_B.5 | IC1.26 30.8,48.9 32.38,47.94 34.92,47.94 35.56,47.31 35.56,46.04 36.83,44.77 36.83,42.23 38.1,42.23 38.1,39.05 v37.15,39.05 | v38.73,37.15 38.73,36.83 39.37,36.2 39.37,29.84 41.27,29.21 45.09,29.21 45.72,29.84 45.72,30.48 52.07,30.48 52.07,21.59 v51.75,21.59 | v49.85,17.78 52.07,17.78 52.07,20 53.34,20 53.34,22.23 58.74,22.23 v58.74,23.18
SPI2_MISO
  Top 0.406: SPI2/I2S2.4 STM32_R.14 56.52,39.37 57.15,38.73 57.15,37.47 56.52,36.83 56.52,36.2 52.39,36.2 51.44,36.83 49.85,36.83 49.53,36.51 48.58,34.92 45.4,34.92 44.77,34.29 43.18,34.29 43.18,29.84 42.55,29.21 ENC28J60.8
SPI2_MOSI  (via drill 0.5)
  Top 0.406: SPI2/I2S2.3 53.98,41.91 54.61,41.27 54.61,40.01 55.24,39.37 STM32_R.13 | v54.61,32.7 54.29,32.7 54.29,32.38 53.98,32.07 52.39,29.84 52.39,26.04 51.75,26.04 51.75,23.5 v51.12,23.5 | v46.67,25.4 ENC28J60.5
  Bottom 0.406: STM32_R.13 55.24,36.83 55.24,35.88 54.93,35.88 54.93,33.02 54.61,33.02 v54.61,32.7 | v51.12,23.5 49.53,25.72 48.9,26.35 47.31,26.35 v46.67,25.4
SPI2_NSS  (via drill 0.5)
  Top 0.406: SPI2/I2S2.6 59.69,42.55 59.05,41.91 STM32_R.16 | v50.8,34.92 52.39,34.92 49.85,31.11 49.85,28.57 v48.9,28.57 | v46.67,27.94 46.35,27.94 45.09,29.21 43.81,29.21 43.18,28.57 43.18,27.3 42.55,26.67 41.27,26.67 40.64,27.3 40.64,28.57 41.27,29.21 ENC28J60.10
  Bottom 0.406: STM32_R.16 57.15,40.01 56.52,39.37 55.24,39.37 54.61,38.73 54.61,37.47 53.98,36.83 53.98,35.56 52.07,35.56 v50.8,34.92 | v48.9,28.57 47.94,28.57 47.94,27.94 v46.67,27.94
SPI2_SCK
  Top 0.406: SPI2/I2S2.5 57.78,41.91 57.15,41.27 57.15,40.01 57.78,39.37 STM32_R.15 58.42,34.92 53.34,34.92 50.48,30.8 50.48,27.94 49.85,27.94 49.85,26.35 46.35,26.35 45.09,27.94 ENC28J60.7
SWD_CLK  (via drill 0.5)
  Top 0.406: v26.99,36.51 26.67,36.51 26.67,35.24 21.27,35.24 20.95,35.56 19.68,35.56 19.37,35.24 SWD.1
  Bottom 0.406: STM32_T.16 34.29,36.2 33.66,36.83 27.3,36.83 v26.99,36.51
SWD_IO  (via drill 0.5)
  Top 0.406: v21.27,46.67 21.91,46.67 21.91,48.58 39.69,48.58 40.64,47.94 45.72,47.94 45.72,46.04 v46.67,46.04
  Bottom 0.406: SWD.2 19.68,37.78 19.68,43.81 19.37,44.13 17.78,44.13 17.78,45.72 21.91,45.72 21.91,46.67 v21.27,46.67 | v46.67,46.04 46.99,46.04 46.99,37.47 46.35,36.83 43.81,36.83 43.18,37.47 STM32_R.3
VDD  (via drill 0.5)
  Top 0.406: v32.07,21.91 31.75,21.91 31.75,30.48 SPI3/I2S3.2 | STM32_B.16 60.33,36.83 59.69,37.47 59.69,38.73 60.33,39.37 ENC_PW.2 61.59,41.91 62.23,42.55 62.23,43.81 61.59,44.45 53.66,44.45 v53.66,44.77 | STM32_B.3 64.77,20.95 65.41,21.59 66.67,21.59 67.31,22.23 67.31,27.3 SPI1.2 64.77,28.57 64.14,29.21 60.33,29.21 59.69,28.57 | v59.37,33.34 59.69,33.02 59.69,28.57 | VXX{,A}.1 55.88,26.67 59.69,26.67 59.69,28.57 | SWD.3 v23.18,40.32 | IC2.TAB v13.34,26.35 | v37.15,15.56 37.47,15.56 37.47,14.61 37.78,13.65 37.78,8.26 IC1.2 | STM32_R.1 v37.15,40.32 | v34.61,45.09 v30.48,45.09
  Bottom 0.406: v32.07,21.91 31.75,21.91 31.75,19.68 32.38,19.05 36.83,19.05 STM32_T.1 37.47,15.56 v37.15,15.56 | v53.66,44.77 53.66,44.45 52.7,44.45 52.07,43.81 SPI2/I2S2.2 51.44,41.91 52.07,41.27 52.07,40.01 51.44,39.37 50.16,39.37 49.53,38.73 49.53,34.92 41.59,34.92 41.59,35.24 40.01,36.2 40.01,38.1 STM32_R.1 | STM32_B.16 60.33,34.29 59.69,33.66 59.69,33.02 v59.37,33.34 | 14.92,43.69 C_3.3V.+ 11.11,44.45 5.71,44.45 4.45,43.18 LED3.A | 14.92,43.69 14.92,40.32 SWD.3 | v23.18,40.32 22.54,40.32 22.54,34.61 21.59,34.61 21.59,31.11 | 21.59,31.11 21.59,30.8 24.77,30.8 24.83,30.86 U$2.4 25.72,30.48 SPI3/I2S3.2 | v13.34,26.35 15.24,26.35 15.24,31.75 17.78,31.75 17.78,31.11 21.59,31.11 | 14.92,43.69 18.1,48.9 22.54,48.9 22.86,48.58 27.94,48.58 28.57,47.94 29.84,47.94 30.48,47.31 v30.48,45.09 | v37.15,40.32 36.2,40.96 36.2,44.13 35.24,45.09 v34.61,45.09